# Altium schematic sheet PowerSupply.SchDoc
size A
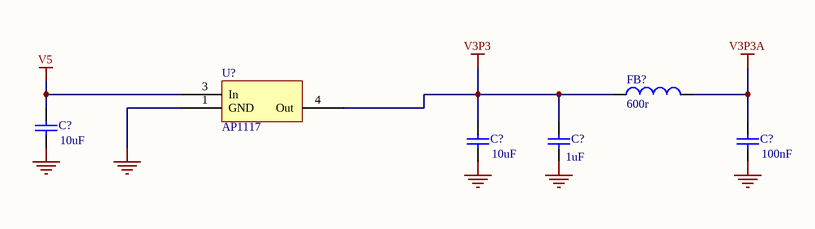
[diagram p0: PowerSupply.SchDoc]

## Parts
(Parts that share a designator on the sheet are numbered #1, #2 ... from top to bottom, then left to right.)
C?#1  value 10uF  [RAD-0.3]  (hidden comment: Cap)
C?#2  value 100nF  [RAD-0.3]  (hidden comment: Cap)
C?#3  value 10uF  [RAD-0.3]  (hidden comment: Cap)
C?#4  value 1uF  [RAD-0.3]  (hidden comment: Cap)
FB?  600r  [0402-A]
U?  AP1117

## Nets
GND: C?#1.1 C?#2.2 C?#3.1 C?#4.1 U?.1(GND)
V3P3: C?#3.2 C?#4.2 FB?.1 U?.4(Out)
V3P3A: C?#2.1 FB?.2
V5: C?#1.2 U?.3(In)

## Library data of the parts
C?#1-C?#4 = Cap: Capacitor; Published: 8-Jun-2000; LatestRevisionDate: 17-Jul-2002; LatestRevisionNote: Re-released for DXP Platform.; PackageReference: RAD-0.3; Publisher: Altium Limited; PackageDescription: Radial Cap, Thru-Hole; 2 Leads; 0.3 in Pin Spacing
FB? = Inductor: Code_IEC: 1005; Published: 8-Jun-2000; LatestRevisionDate: 29-May-2009; LatestRevisionNote: IPC-7351 Footprint Added.; PackageReference: 0402-A; Publisher: Altium Limited; PackageDescription: Chip Inductor; Code_JEITA: 0402